# EAGLE schematic V0.1 (EAGLE 7.6.0)
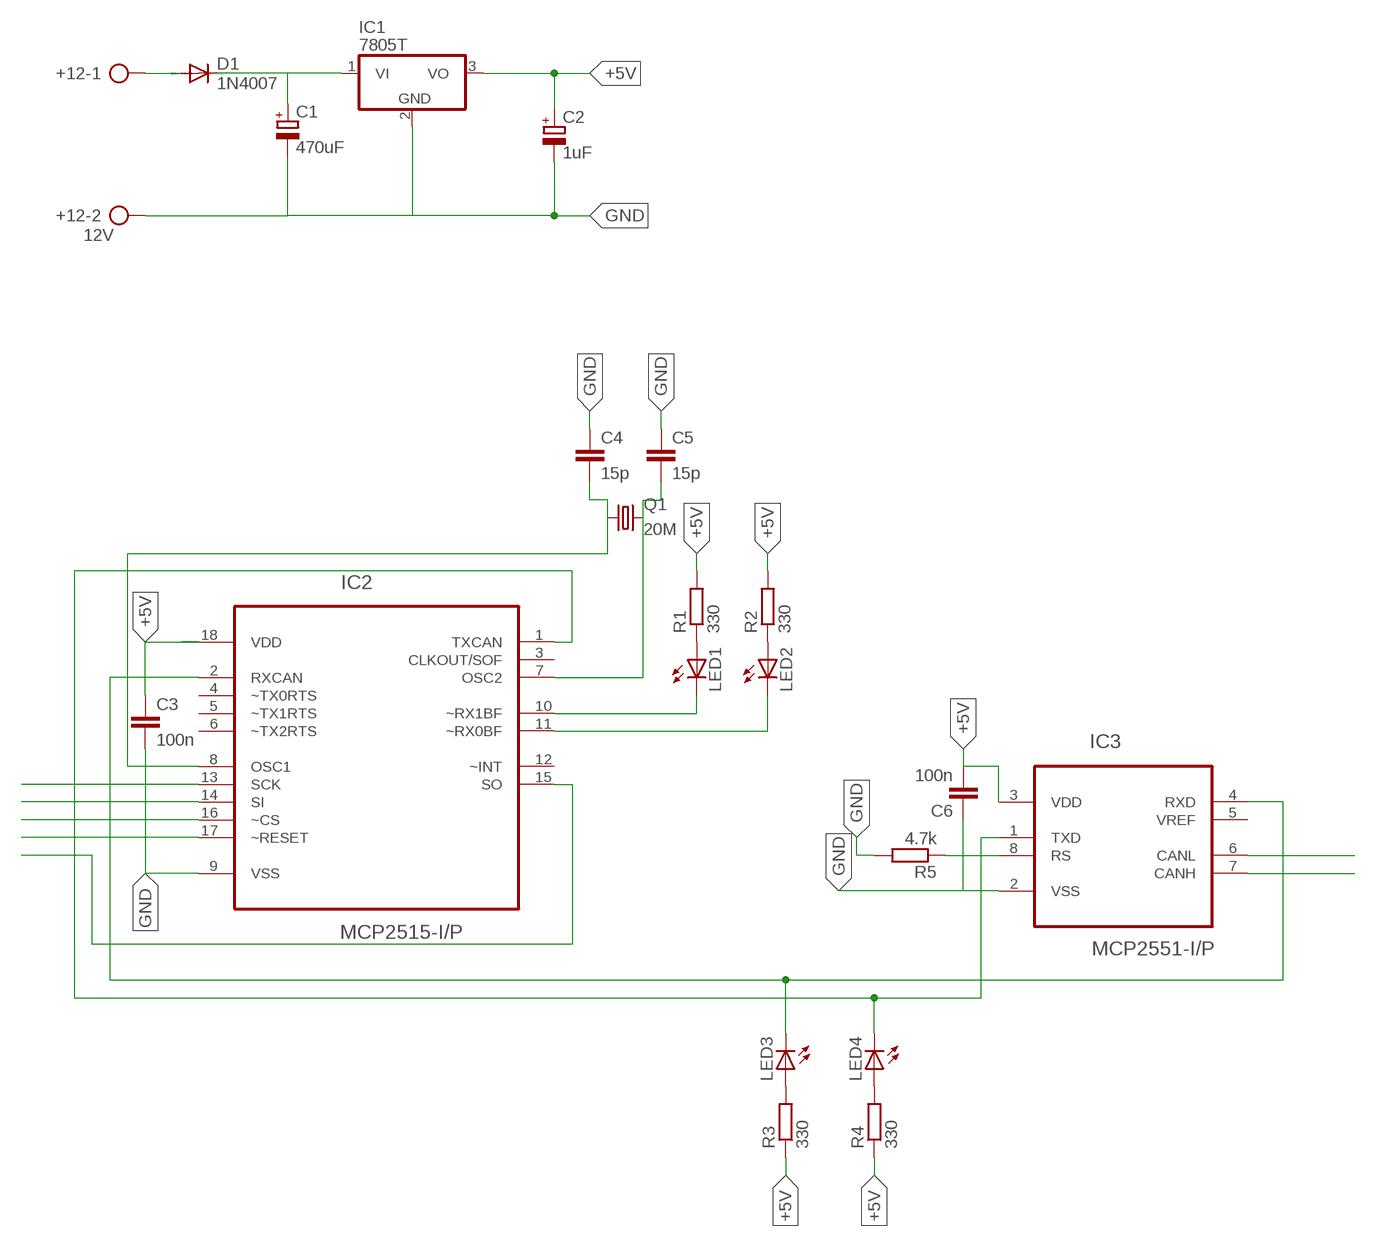
[diagram p0: schematic, sheet 1]

## Parts
+12  12V  AK300/2  [AK300/2]
C1  470uF  CPOL-EUE3.5-8  [E3,5-8]
C2  1uF  CPOL-EUE2.5-5  [E2,5-5]
C3  100n  C-EU050-025X075  [C050-025X075]
C4  15p  C-EU025-024X044  [C025-024X044]
C5  15p  C-EU025-024X044  [C025-024X044]
C6  100n  C-EU050-025X075  [C050-025X075]
D1  1N4007  1N4004  [DO41-10]
IC1  7805T  [TO220H]
IC2  MCP2515-I/P  [DIP254P762X432-18]
IC3  MCP2551-I/P  [DIP254P762X432-8]
LED1  LED3MM  [LED3MM]
LED2  LED3MM  [LED3MM]
LED3  LED3MM  [LED3MM]
LED4  LED3MM  [LED3MM]
Q1  20M  CRYSTALHC49S  [HC49/S]
R1  330  R-EU_0204/5  [0204/5]
R2  330  R-EU_0204/5  [0204/5]
R3  330  R-EU_0204/5  [0204/5]
R4  330  R-EU_0204/5  [0204/5]
R5  4.7k  R-EU_0204/7  [0204/7]

## Nets
+5V: C2.+ C3.1 C6.2 IC1.3(VO) IC2.18(VDD) IC3.3(VDD) R1.2 R2.2 R3.1 R4.1
GND: +12.2 C1.- C2.- C3.2 C4.1 C5.1 C6.1 IC1.2(GND) IC2.9(VSS) IC3.2(VSS) R5.2
N$1: +12.1 D1.A
N$2: C1.+ D1.C IC1.1(VI)
N$3: LED1.A R1.1
N$4: LED2.A R2.1
N$5: IC2.10(~RX1BF) LED1.K(C)
N$6: IC2.11(~RX0BF) LED2.K(C)
N$7: IC2.2(RXCAN) IC3.4(RXD) LED3.K(C)
N$8: IC2.1(TXCAN) LED4.K(C)
N$9: IC2.17(~RESET)
N$10: IC2.16(~CS)
N$11: IC2.14(SI)
N$12: IC2.13(SCK)
N$13: IC2.15(SO)
N$14: C5.2 IC2.7(OSC2) Q1.2
N$15: C4.2 IC2.8(OSC1) Q1.1
N$16: LED3.A R3.2
N$17: LED4.A R4.2
N$18: IC3.8(RS) R5.1
N$19: IC3.6(CANL)
N$20: IC3.7(CANH)
Unconnected: IC2.3(CLKOUT/SOF) IC2.4(~TX0RTS) IC2.5(~TX1RTS) IC2.6(~TX2RTS) IC2.12(~INT) IC3.1(TXD) IC3.5(VREF)

## Library data of the parts
+12 = con-ptr500:AK300/2: CONNECTOR; OC_FARNELL: unknown; OC_NEWARK: unknown
C1 C2 = rcl:CPOL-EU: POLARIZED CAPACITOR, European symbol
C3-C6 = rcl:C-EU: CAPACITOR, European symbol
D1 = diode:1N4004: DIODE general purpose rectifier, 1 A
IC1 = linear:78*: Positive VOLTAGE REGULATOR Source: http://cache.national.com/ds/LM/LM78L05.pdf http://www.fairchildsemi.com/ds/LM/LM7805.pdf
IC2 = MCP2515-IP:MCP2515-I/P: Stand-Alone CAN Controller; DESCRIPTION: CAN CONTRL; MPN: MCP2515-I/P; OC_FARNELL: 1439391; OC_NEWARK: 61K2945; PACKAGE: PDIP-18; SUPPLIER: MICROCHIP
IC3 = MCP2551-IP:MCP2551-I/P: High-Speed CAN Transceiver; DESCRIPTION: CAN CTRL; MPN: MCP2551-I/P; OC_FARNELL: 1292240; OC_NEWARK: 61K2947; PACKAGE: PDIP-8; SUPPLIER: Microchip
LED1-LED4 = led:LED: LED OSRAM: - CHIPLED LG R971, LG N971, LY N971, LG Q971, LY Q971, LO R971, LY R971 LH N974, LH R974 LS Q976, LO Q976, LY Q976 LO Q996 - Hyper CHIPLED LW Q18S LB Q993, LB Q99A, LB R99A - SideLED LS A670, LO A670, LY A670, LG A670, LP A670 LB A673, LV A673, LT A673, LW A673 LH A674 LY A675 LS A676, LA A676, LO A676, LY A676, LW A676 LS A679, LY A679, LG A679 - Hyper Micro SIDELED® LS Y876, LA Y876, LO Y876, LY Y876 LT Y87S - SmartLED LW L88C, LW L88S LB L89C, LB L89S, LG L890 LS L89K, LO L89K, LY L89K LS L896, LA L896, LO L896, LY L896 - TOPLED LS T670, LO T670, LY T670, LG T670, LP T670 LSG T670, LSP T670, LSY T670, LOP T670, LYG T670 LG T671, LOG T671, LSG T671 LB T673, LV T673, LT T673, LW T673 LH T674 LS T676, LA T676, LO T676, LY T676, LB T676, LH T676, LSB T676, LW T676 LB T67C, LV T67C, LT T67C, LS T67K, LO T67K, LY T67K, LW E67C LS E67B, LA E67B, LO E67B, LY E67B, LB E67C, LV E67C, LT E67C LW T67C LS T679, LY T679, LG T679 LS T770, LO T770, LY T770, LG T770, LP T770 LB T773, LV T773, LT T773, LW T773 LH T774 LS E675, LA E675, LY E675, LS T675 LS T776, LA T776, LO T776, LY T776, LB T776 LHGB T686 LT T68C, LB T68C - Hyper Mini TOPLED® LB M676 - Mini TOPLED Santana® LG M470 LS M47K, LO M47K, LY M47K Source: http://www.osram.convergy.de LUXEON: - LUMILED® LXK2-PW12-R00, LXK2-PW12-S00, LXK2-PW14-U00, LXK2-PW14-V00 LXK2-PM12-R00, LXK2-PM12-S00, LXK2-PM14-U00 LXK2-PE12-Q00, LXK2-PE12-R00, LXK2-PE12-S00, LXK2-PE14-T00, LXK2-PE14-U00 LXK2-PB12-K00, LXK2-PB12-L00, LXK2-PB12-M00, LXK2-PB14-N00, LXK2-PB14-P00, LXK2-PB14-Q00 LXK2-PR12-L00, LXK2-PR12-M00, LXK2-PR14-Q00, LXK2-PR14-R00 LXK2-PD12-Q00, LXK2-PD12-R00, LXK2-PD12-S00 LXK2-PH12-R00, LXK2-PH12-S00 LXK2-PL12-P00, LXK2-PL12-Q00, LXK2-PL12-R00 Source: www.luxeon.com KINGBRIGHT: KA-3528ASYC Source: www.kingbright.com
Q1 = crystal:CRYSTAL: CRYSTAL; OC_FARNELL: 1667008; OC_NEWARK: unknown
R1-R5 = rcl:R-EU_: RESISTOR, European symbol